# Altium schematic sheet Feedforward Controller.SchDoc
size B; SheetNumber: 5; SheetTotal: 7
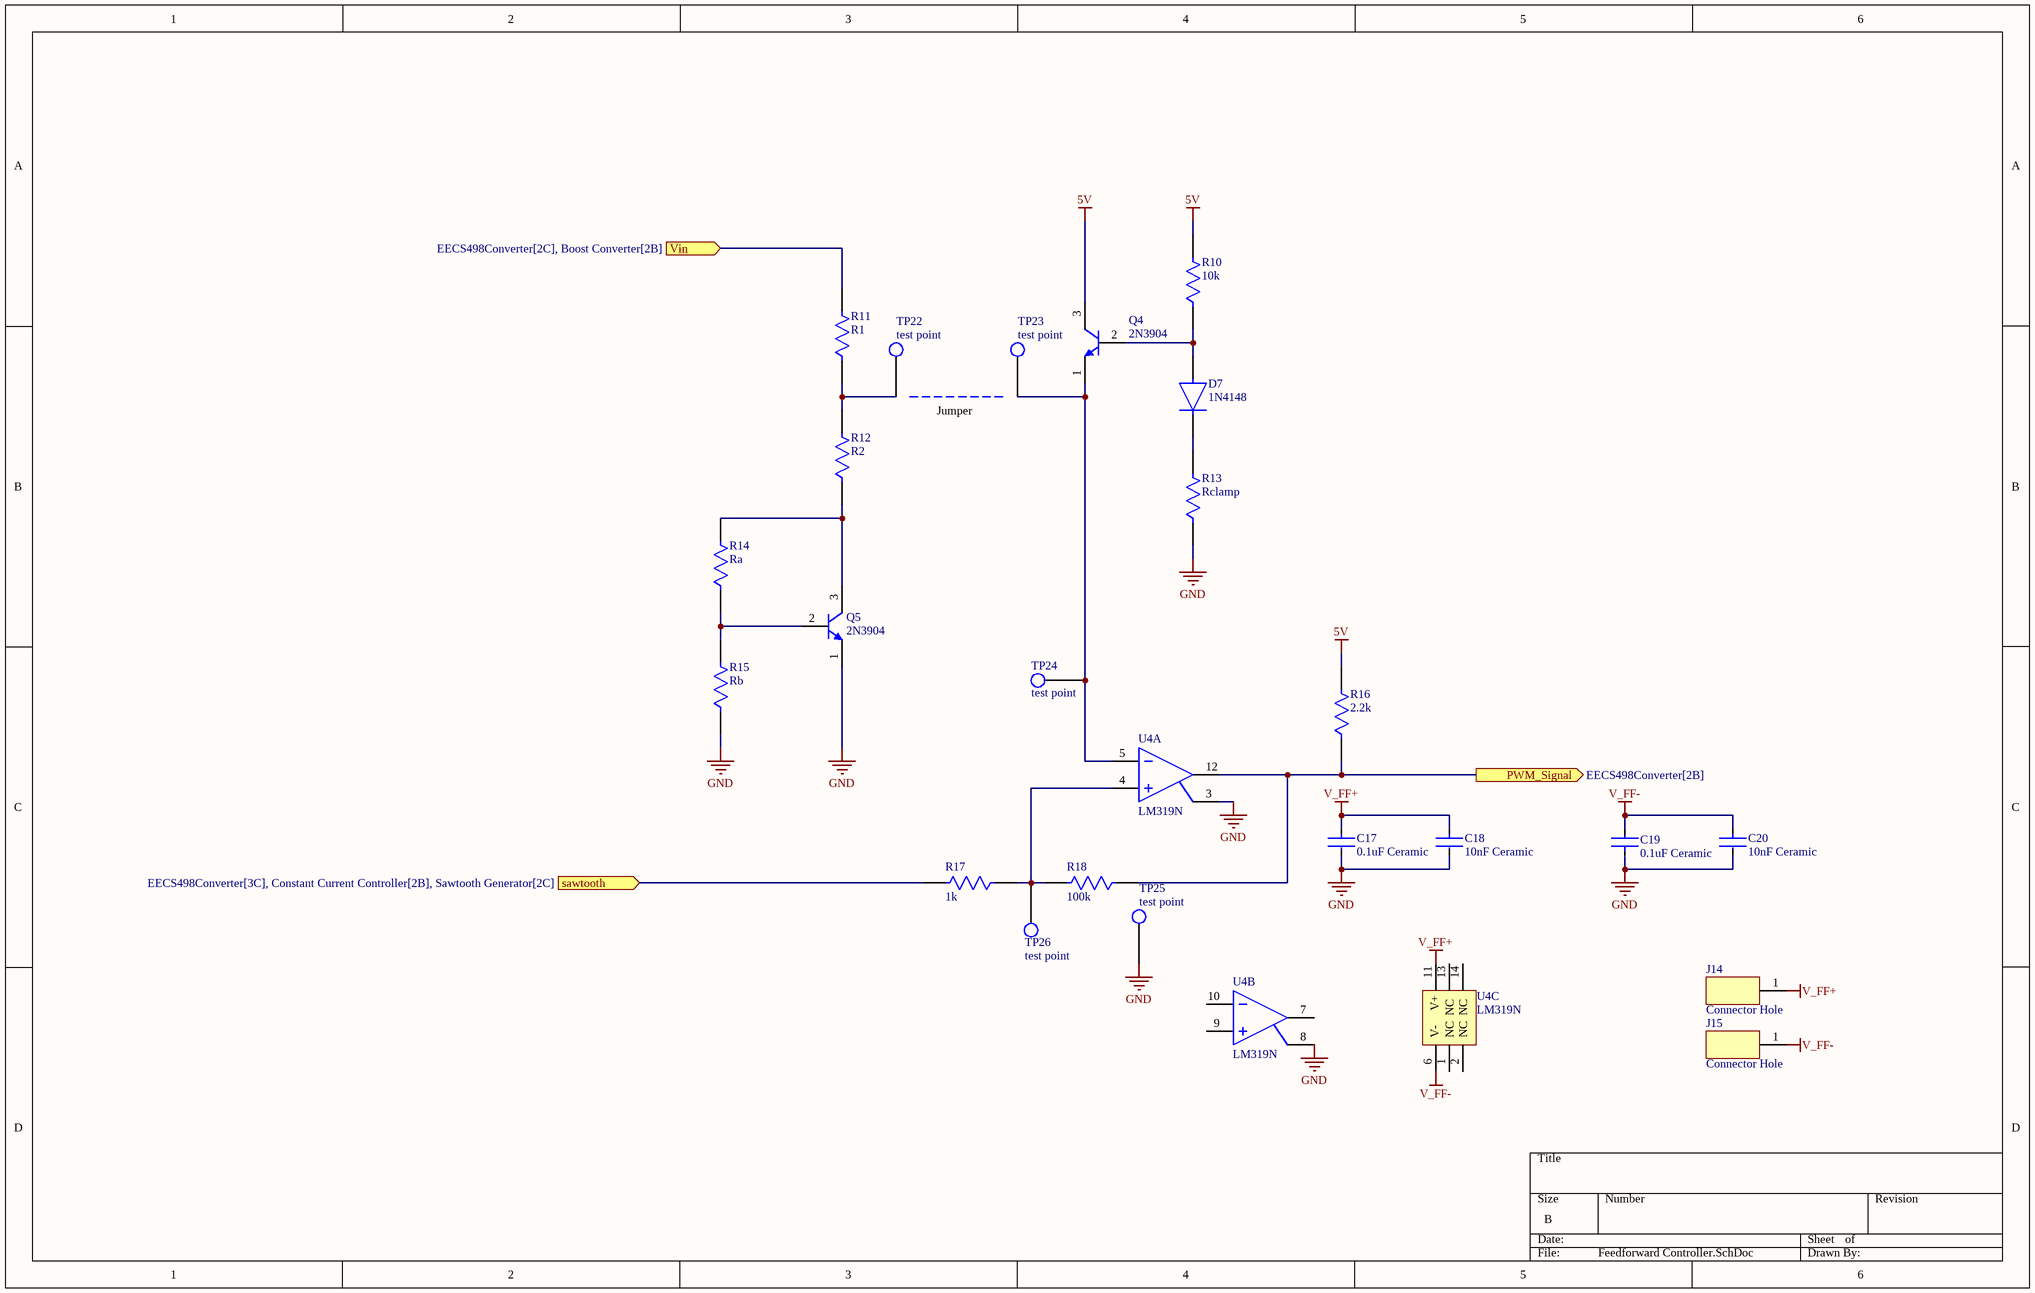
[diagram p0: Feedforward Controller.SchDoc]

## Parts
C17  0.1uF Ceramic  [FP-K15H5-MFG]
C18  10nF Ceramic  [FP-K15H5-MFG]
C19  0.1uF Ceramic  [FP-K15H5-MFG]
C20  10nF Ceramic  [FP-K15H5-MFG]
D7  1N4148  [FP-1N4148-MFG]
J14  Connector Hole  [Connector Hole]
J15  Connector Hole  [Connector Hole]
Q4  2N3904  [2N3906TF]
Q5  2N3904  [2N3906TF]
R10  10k  [FP-RLR07-MFG]
R11  R1  [FP-RLR07-MFG]
R12  R2  [FP-RLR07-MFG]
R13  Rclamp  [FP-RLR07-MFG]
R14  Ra  [FP-RLR07-MFG]
R15  Rb  [FP-RLR07-MFG]
R16  2.2k  [FP-RLR07-MFG]
R17  1k  [FP-RLR07-MFG]
R18  100k  [FP-RLR07-MFG]
TP22  test point  [test point]
TP23  test point  [test point]
TP24  test point  [test point]
TP25  test point  [test point]
TP26  test point  [test point]
U4  LM319N  [LM319_DIP14]  (parts A,B,C of 3)

## Ports
PWM_Signal (out, see EECS498Converter[2B]), sawtooth (in, see EECS498Converter[3C], Constant Current Controller[2B], Sawtooth Generator[2C]), Vin (in, see EECS498Converter[2C], Boost Converter[2B])

## Nets
5V: Q4.3(C) R10.2 R16.2
GND: C17.2 C18.2 C19.1 C20.2 Q5.1(E) R13.1 R15.1 TP25.1 U4.3(GND1) U4.8(GND2)
V_FF+: C17.1 C18.1 J14.1 U4.11(V+)
V_FF-: C19.2 C20.1 J15.1 U4.6(V-)
PWM_Signal: R16.1 R18.1 U4.12(OUT1) ; port PWM_Signal
sawtooth: R17.2 ; port sawtooth
Vin: R11.2 ; port Vin
NetD7_1: D7.1(C) R13.2
NetD7_2: D7.2(A) Q4.2(B) R10.1
NetQ4_1: Q4.1(E) TP23.1 TP24.1 U4.5(IN1-)
NetQ5_2: Q5.2(B) R14.1 R15.2
NetQ5_3: Q5.3(C) R12.1 R14.2
NetR11_1: R11.1 R12.2 TP22.1
NetR17_1: R17.1 R18.2 TP26.1 U4.4(IN1+)

Not connected (* = marked no-connect by the designer): U4 1(NC) 2(NC) 7(OUT2) 9(IN2+) 10(IN2-) 13(NC) 14(NC)

## Notes on the sheet
- Jumper

## Library data of the parts
C17 C19 = 0.1uF Capacitor: CAP CER 0.1UF 50V X7R RADIAL; Capacitance: 100nF; Tolerance: 10%; Lead Length: 30mm; Lead Diameter: 0.5mm; Lead/Base Style: Formed Leads; Diameter: 500um; Max Operating Temperature: 125°C; Dielectric Material: Ceramic; Case/Package: Dipped; Dielectric: X7R; Lead Free: Lead Free; Construction: RADIAL; Voltage: 50V; Thickness: 2.6mm; Min Operating Temperature: -55°C; Lead Pitch: 5mm; Height: 4mm; Radiation Hardening: No; Voltage Rating: 50V; Depth: 2.5mm; Voltage Rating (DC): 50V; Package Quantity: 1; Weight: 0.005644oz; Series: K; Mount: Through Hole; Termination: Radial; Height - Seated (Max): 0.257inch; Length: 4mm; Packaging: Tape and Reel; Width: 2.5mm; RoHS Compliant: Yes
C18 C20 = 10nF Capacitor: CAP CER 10nF 50V X7R RADIAL; Capacitance: 100nF; Tolerance: 10%; Lead Length: 30mm; Lead Diameter: 0.5mm; Lead/Base Style: Formed Leads; Diameter: 500um; Max Operating Temperature: 125°C; Dielectric Material: Ceramic; Case/Package: Dipped; Dielectric: X7R; Lead Free: Lead Free; Construction: RADIAL; Voltage: 50V; Thickness: 2.6mm; Min Operating Temperature: -55°C; Lead Pitch: 5mm; Height: 4mm; Radiation Hardening: No; Voltage Rating: 50V; Depth: 2.5mm; Voltage Rating (DC): 50V; Package Quantity: 1; Weight: 0.005644oz; Series: K; Mount: Through Hole; Termination: Radial; Height - Seated (Max): 0.257inch; Length: 4mm; Packaging: Tape and Reel; Width: 2.5mm; RoHS Compliant: Yes
D7 = 1N4148: DIODE GEN PURP 100V 200MA DO35; Forward Voltage: 1V; Max Power Dissipation: 500mW; Max Reverse Current: 5uA; Forward Current: 300mA; Current: 4A; Reverse Recovery Time: 4ns; Element Configuration: Single; Outside Diameter: 1.85mm; Capacitance: 4pF; Polarity: Standard; Max Forward Surge Current (Ifsm): 1A; Reverse Voltage: 100V; Output Current: 200mA; Average Rectified Current: 200mA; Diameter: 1.91mm; Max Repetitive Reverse Voltage (Vrrm): 100V; Current Rating: 200mA; Case/Package: DO-35; Lead Free: Lead Free; Number of Pins: 2; Recovery Time: 4ns; Packaging: Bulk; Contact Plating: Tin; Voltage: 100V; Mount: Through Hole; Max Surge Current: 4A; Package Quantity: 2000; Width: 1.91mm; Max Reverse Voltage (DC): 100V; Length: 4.56mm; Radiation Hardening: No; Power Dissipation: 500mW; Voltage Rating (DC): 100V; Peak Non-Repetitive Surge Current: 4A; REACH SVHC: No SVHC; Height: 4.56mm; Max Operating Temperature: 175°C; Series: -; Weight: 0.01lb; Min Operating Temperature: -65°C
Q4 Q5 = 2N3904: General Purpose Transistor, NPN Silicon, 200 mA, 60 V, -55 to 150 degC, 3-Pin TO-92, RoHS, Bulk; Manufacturer: ONSemiconductor; Emitter- Base Voltage VEBO: 6V; Maximum Power Dissipation: 625mW; Maximum DC Collector Current: 0.2A; Collector- Emitter Voltage VCEO Max: 40V; Collector- Base Voltage VCBO: 60V; DC Collector/Base Gain hfe Min: 60; Configuration: Single; Collector-Emitter Saturation Voltage: 0.3V; Gain Bandwidth Product fT: 270MHz; Mounting Style: ThroughHole; Package / Case: TO-92-3(TO-226); Mounting Technology: ThroughHole; Minimum Operating Temperature: -65C; Datasheet Version: Rev. 8, 08/2012; Product Category: BipolarTransistors-BJT; Factory Pack Quantity: 5000; Transistor Polarity: NPN; Package Description: 3-Pin Transistor Outline, Body 4.825 x 3.685 mm, Pitch 1.27 mm; RoHS: Details; Datasheet URL: https://datasheet.ciiva.com/4725/2n3903-d-285841-4725808.pdf; Packaging: Bulk; Maximum Operating Temperature: +150C; Package Reference: TO-92-3-29-11; Brand: ONSemiconductor; Manufacturer URL: http://www.onsemi.com/
R10-R18 = Resistor: Resistor, ± 1%, 250 mW, Axial Leaded, Metal Film, Military Reliability; NexarPartId: 39453770; Max Power Dissipation: 250mW; Resistance: 100kΩ; Lead Length: 38.1mm; Voltage Rating: 250V; Lead Diameter: 640µm; Temperature Coefficient: 100ppm/°C; Wire/Cable Diameter: 50.8µm; Military Standard: MIL-PRF-39017; REACH SVHC: Unknown; Min Operating Temperature: -65°C; Length: 7.62mm; Case/Package: Axial; Lead Free: Contains Lead; Height: 2.5mm; Contact Plating: Lead, Tin; Radiation Hardening: No; Composition: Metal Film; Voltage Rating (DC): 250V; Schedule B: 8533210090, 8533210090|8533210090, 8533210090|8533210090|8533210090, 8533210090|8533210090|8533210090|8533210090; Diameter: 2.29mm; Tolerance: 1%; Max Operating Temperature: 150°C; Number of Terminations: 2; RoHS: Non-Compliant; Features: Military, Moisture Resistant, Weldable; Power Rating: 250mW; Packaging: Bulk; Width: 2.29mm; Termination: Axial; Failure Rate: 0.001%
U4 = LM319N: High Speed Dual Comparator, 14-pin MDIP; Manufacturer: Texas Instruments; PowerWise: N; PackageTopMarking: NSUZXYYTTE#*LM319N; CompType: Amplifiers; ComponentLink1Description: Datasheet URL; PinCount: 14; PackageDescription: MDIP, .750 x .250 x.130in, 14 Lead, .100in Pitch; ComponentLink1URL: http://www.ti.com/general/docs/lit/getliterature.tsp?genericPartNumber=LM319-N&fileType=pdf; Package Reference: NFF0014A; RoHS: N; Code_JEDEC: MS-001-AA